# EAGLE design esp32_cam_rev_A (EAGLE 9.3.1)
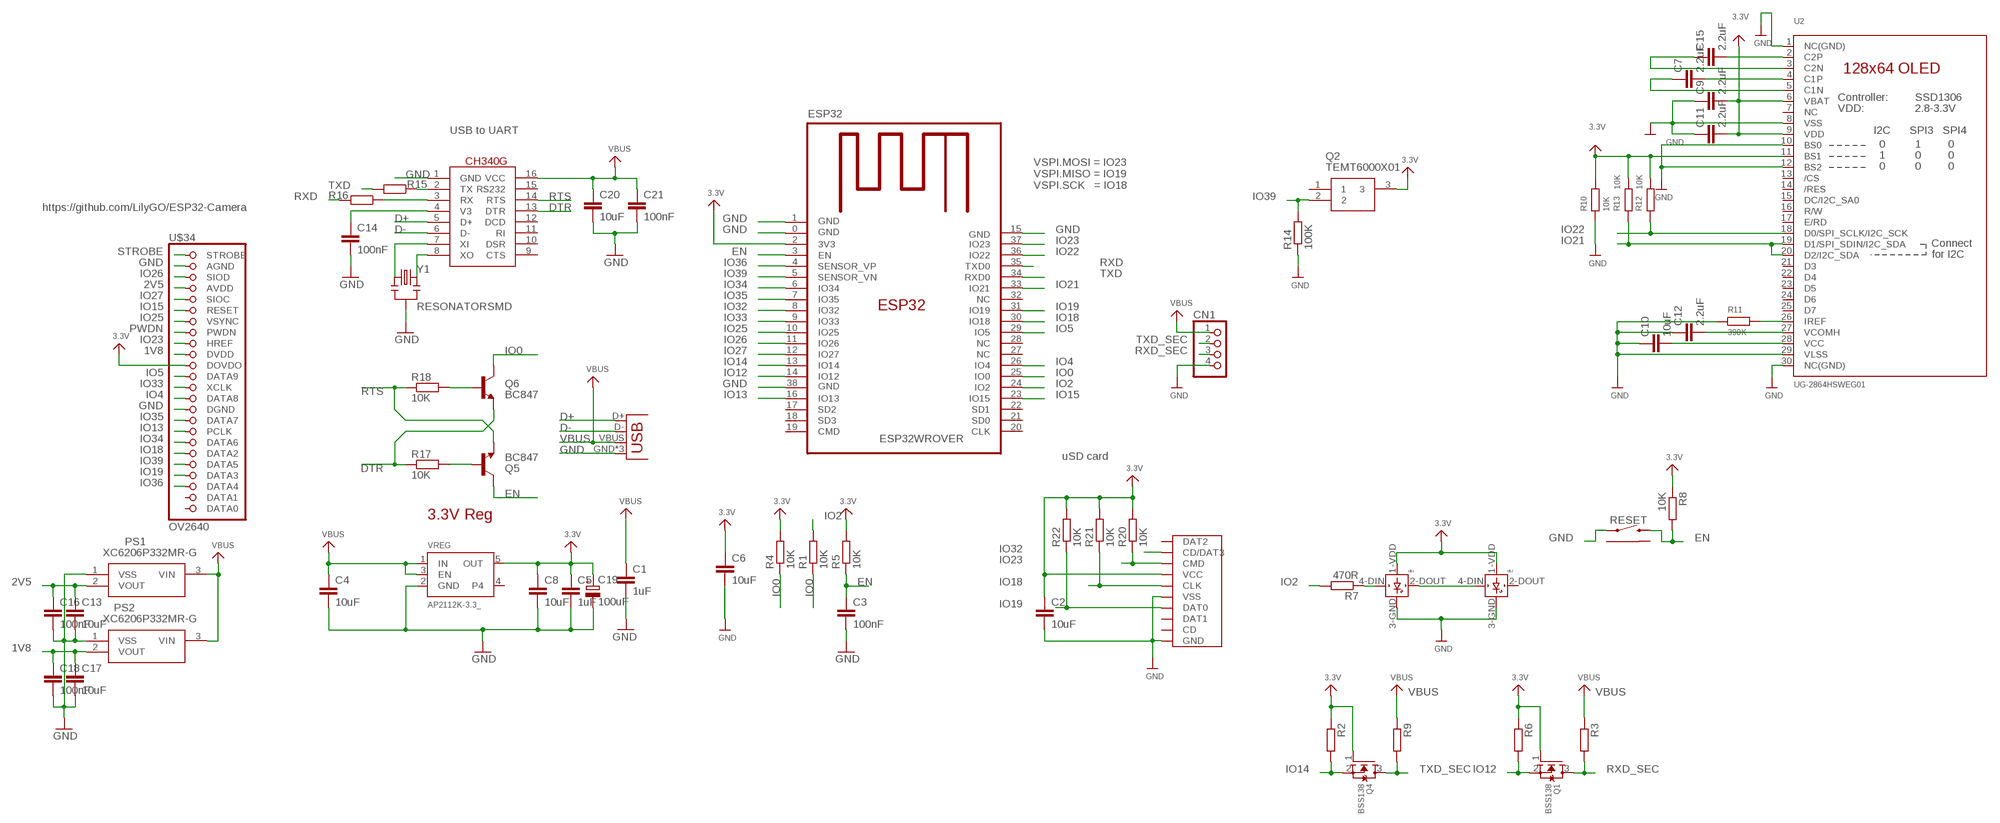
[diagram p0: schematic, sheet 1]

## Parts
C1  1uF  C-EUC0805K  [C0805K]
C2  10uF  C-EUC0805K  [C0805K]
C3  100nF  C-EUC0805K  [C0805K]
C4  10uF  C-EUC0805K  [C0805K]
C5  1uF  C-EUC0805K  [C0805K]
C6  10uF  C-EUC0805K  [C0805K]
C7  2.2uF  C-EUC0805  [C0805]
C8  10uF  C-EUC0805K  [C0805K]
C9  2.2uF  C-EUC0805  [C0805]
C10  10uF  C-EUC0805  [C0805]
C11  2.2uF  C-EUC0805  [C0805]
C12  2.2uF  C-EUC0805  [C0805]
C13  10uF  C-EUC0805K  [C0805K]
C14  100nF  C-EUC0805K  [C0805K]
C15  2.2uF  C-EUC0805  [C0805]
C16  100nF  C-EUC0805K  [C0805K]
C17  10uF  C-EUC0805K  [C0805K]
C18  100nF  C-EUC0805K  [C0805K]
C19  100uF  CPOL-EUCT6032  [CT6032]
C20  10uF  C-EUC0805K  [C0805K]
C21  100nF  C-EUC0805K  [C0805K]
CN1  JST_PH4  [JSTPH4]
ESP32  ESP32WROVER  [ESP32WROVER]
PS1  XC6206P332MR-G  [SOT95P280X130-3N]
PS2  XC6206P332MR-G  [SOT95P280X130-3N]
Q1  BSS138  MOSFET_N_  [SOT95P240X110-3]
Q2  TEMT6000X01  [TEMT6000X01]
Q4  BSS138  MOSFET_N_  [SOT95P240X110-3]
Q5  BC847  TRANSISTOR_NPNSOT23-3  [SOT23-3]
Q6  BC847  TRANSISTOR_NPNSOT23-3  [SOT23-3]
R1  10K  R-EU_R0805  [R0805]
R2  10K  R-EU_R0805  [R0805]
R3  10K  R-EU_R0805  [R0805]
R4  10K  R-EU_R0805  [R0805]
R5  10K  R-EU_R0805  [R0805]
R6  10K  R-EU_R0805  [R0805]
R7  470R  R-EU_R0805  [R0805]
R8  10K  R-EU_R0805  [R0805]
R9  10K  R-EU_R0805  [R0805]
R10  10K  R-EU_R0805  [R0805]
R11  390K  R-EU_R0805  [R0805]
R12  10K  R-EU_R0805  [R0805]
R13  10K  R-EU_R0805  [R0805]
R14  100K  R-EU_R0805  [R0805]
R15  470R  R-EU_R0805  [R0805]
R16  470R  R-EU_R0805  [R0805]
R17  10K  R-EU_R0805  [R0805]
R18  10K  R-EU_R0805  [R0805]
R20  10K  R-EU_R0805  [R0805]
R21  10K  R-EU_R0805  [R0805]
R22  10K  R-EU_R0805  [R0805]
RESET  TACTILE_SWITCH_RIGHT_ANGLE_THT"  [TACTILE_SWITCH_RIGHT_ANGLE_THT]
SD_CARD  MICRO_SD_CARD"  [TFP09-2--12B]
U2  UG-2864HSWEG01  DISP_OLED_UG-2864HSWEG01_  [UG-2864HSWEG01_1.3_WRAPAROUND_MIRRORED]
U$1  WS2812B  [WS2812B_5050]
U$2  WS2812B  [WS2812B_5050]
U$23  CH340G  [SO16]
U$34  OV2640  [FH12-24S-0.5SH]
USB  USB_MICRO_ATTEND_  [USB_MICRO]
VREG  AP2112K-3.3_  [SOT95P290X120-5]
Y1  RESONATORSMD  [RESONATOR-SMD]

## Nets
1V8: C17.1 C18.1 PS2.2(VOUT) U$34.10(DVDD)
2V5: C13.1 C16.1 PS1.2(VOUT) U$34.4(AVDD)
3.3V: C2.1 C5.1 C6.1 C8.1 C9.2 C11.2 C19.+ ESP32.2(3V3) Q1.1(G) Q2.3 Q4.1(G) R2.1 R4.2 R5.2 R6.1 R8.1 R10.2 R12.2 R13.2 R20.2 R21.2 R22.2 SD_CARD.VCC U2.6(VBAT) U2.9(VDD) U2.11(BS1) U$1.1-VDD(VDD) U$2.1-VDD(VDD) U$34.11(DOVDO) VREG.5(OUT)
D+: U$23.5(D+) USB.D+
D-: U$23.6(D-) USB.D-
DTR: Q6.2(E) R17.1 U$23.13(DTR)
EN: C3.1 ESP32.3(EN) Q5.3(C) R5.1 R8.2 RESET.2
GND: C1.2 C2.2 C3.2 C4.2 C5.2 C6.2 C8.2 C9.1 C10.1 C11.1 C12.1 C13.2 C14.2 C16.2 C17.2 C18.2 C19.- C20.2 C21.2 CN1.4 ESP32.0(GND) ESP32.1(GND) ESP32.15(GND) ESP32.38(GND) PS1.1(VSS) PS2.1(VSS) R10.1 R11.1 R14.1 RESET.1 SD_CARD.GND SD_CARD.GND@1(GND) SD_CARD.GND@2(GND) SD_CARD.GND@3(VSS) SD_CARD.VSS(GND) U2.1(NC(GND)) U2.8(VSS) U2.10(BS0) U2.12(BS2) U2.29(VLSS) U2.30(NC(GND)) U$1.3-GND(GND) U$2.3-GND(GND) U$23.1(GND) U$34.2(AGND) U$34.15(DGND) USB.GND USB.GND@2(GND) USB.GND@3(GND) VREG.2(GND) Y1.2
IO0: ESP32.25(IO0) Q6.3(C) R1.1 R4.1
IO2: ESP32.24(IO2) R1.2 R7.2
IO4: ESP32.26(IO4) U$34.14(DATA8)
IO5: ESP32.29(IO5) U$34.12(DATA9)
IO12: ESP32.14(IO12) Q1.2(S) R6.2
IO13: ESP32.16(IO13) U$34.17(PCLK)
IO14: ESP32.13(IO14) Q4.2(S) R2.2
IO15: ESP32.23(IO15) U$34.6(RESET)
IO18: ESP32.30(IO18) R21.1 SD_CARD.CLK U$34.19(DATA2)
IO19: ESP32.31(IO19) R22.1 SD_CARD.DAT0 U$34.21(DATA3)
IO21: ESP32.33(IO21) R13.1 U2.19(D1/SPI_SDIN/I2C_SDA) U2.20(D2/I2C_SDA)
IO22: ESP32.36(IO22) R12.1 U2.18(D0/SPI_SCLK/I2C_SCK)
IO23: ESP32.37(IO23) R20.1 SD_CARD.CMD U$34.9(HREF)
IO25: ESP32.10(IO25) U$34.7(VSYNC)
IO26: ESP32.11(IO26) U$34.3(SIOD)
IO27: ESP32.12(IO27) U$34.5(SIOC)
IO32: ESP32.8(IO32) SD_CARD.CD/DAT3
IO33: ESP32.9(IO33) U$34.13(XCLK)
IO34: ESP32.6(IO34) U$34.18(DATA6)
IO35: ESP32.7(IO35) U$34.16(DATA7)
IO36: ESP32.4(SENSOR_VP) U$34.22(DATA4)
IO39: ESP32.5(SENSOR_VN) Q2.2 R14.2 U$34.20(DATA5)
N$2: R7.1 U$1.4-DIN(DIN)
N$3: U$1.2-DOUT(DOUT) U$2.4-DIN(DIN)
N$6: R11.2 U2.26(IREF)
N$7: C15.2 U2.2(C2P)
N$8: U$23.8(XO) Y1.3
N$9: C15.1 U2.3(C2N)
N$10: C7.2 U2.4(C1P)
N$11: C7.1 U2.5(C1N)
N$12: C10.2 U2.28(VCC)
N$13: C12.2 U2.27(VCOMH)
N$16: U$23.7(XI) Y1.1
N$22: C14.1 U$23.4(V3)
N$23: R15.1 U$23.2(TX)
N$24: R16.1 U$23.3(RX)
N$25: Q5.1(B) R17.2
N$26: Q6.1(B) R18.2
PWDN: U$34.8(PWDN)
RTS: Q5.2(E) R18.1 U$23.14(RTS)
RXD: ESP32.35(TXD0) R16.2
RXD_SEC: CN1.3 Q1.3(D) R3.2
STROBE: U$34.1(STROBE)
TXD: ESP32.34(RXD0) R15.2
TXD_SEC: CN1.2 Q4.3(D) R9.2
VBUS: C1.1 C4.1 C20.1 C21.1 CN1.1 PS1.3(VIN) PS2.3(VIN) R3.1 R9.1 U$23.16(VCC) USB.VBUS VREG.1(IN) VREG.3(EN)
Unconnected: ESP32.17(SD2) ESP32.18(SD3) ESP32.19(CMD) ESP32.20(CLK) ESP32.21(SD0) ESP32.22(SD1) ESP32.27(NC) ESP32.28(NC) ESP32.32(NC) Q2.1 RESET.ANCHOR1 RESET.ANCHOR2 SD_CARD.CD SD_CARD.DAT1 SD_CARD.DAT2 U2.7(NC) U2.13(/CS) U2.14(/RES) U2.15(DC/I2C_SA0) U2.16(R/W) U2.17(E/RD) U2.21(D3) U2.22(D4) U2.23(D5) U2.24(D6) U2.25(D7) U$2.2-DOUT(DOUT) U$23.9(CTS) U$23.10(DSR) U$23.11(RI) U$23.12(DCD) U$23.15(RS232) U$34.23(DATA1) U$34.24(DATA0) VREG.4

## Notes on the sheet
- USB to UART
- VSPI.MOSI = IO23
  VSPI.MISO = IO19
  VSPI.SCK   = IO18
- https://github.com/LilyGO/ESP32-Camera
- uSD card
- 3.3V Reg

## Library data of the parts
C1-C18 C20 C21 = rcl:C-EU: CAPACITOR, European symbol; SPICEPREFIX: C
C19 = rcl:CPOL-EU: POLARIZED CAPACITOR, European symbol; SPICEPREFIX: C
CN1 = dronecz:JST_PH4: JST 4-Pin Right-Angle Connector 4UConnector: 17312
ESP32 = dronecz:ESP32WROVER
PS1 PS2 = SamacSys_Parts:XC6206P332MR-G: LDO Voltage Regulators Source: Datasheet <https://www.torexsemi.com/file/xc6206/XC6206.pdf>; DESCRIPTION: LDO Voltage Regulators; HEIGHT: 1.3mm; MANUFACTURER_NAME: Torex; MANUFACTURER_PART_NUMBER: XC6206P332MR-G; MOUSER_PART_NUMBER: 865-XC6206P332MR-G
Q1 Q4 = dronecz:MOSFET_N
Q2 = SamacSys_Parts:TEMT6000X01: Ambient Light Sensor 570nm SMD3 Vishay TEMT6000X01 +/-60 Visible Light Phototransistor, Surface Mount 3-Pin 1206 package Source: Datasheet <https://componentsearchengine.com/Datasheets/1/TEMT6000X01.pdf>; DESCRIPTION: Ambient Light Sensor 570nm SMD3 Vishay TEMT6000X01 +/-60 Visible Light Phototransistor, Surface Mount 3-Pin 1206 package; HEIGHT: mm; MANUFACTURER_NAME: Vishay; MANUFACTURER_PART_NUMBER: TEMT6000X01; MOUSER_PART_NUMBER: 78-TEMT6000
Q5 Q6 = SparkFun:TRANSISTOR_NPN: Transistor NPN BJT configuration in SOT23 package. MMBT2222 is the common NPN we use. Double check BCE configuration again layout.
R1-R18 R20-R22 = rcl:R-EU_: RESISTOR, European symbol; SPICEPREFIX: R
RESET = dronecz:TACTILE_SWITCH_RIGHT_ANGLE_THT
SD_CARD = dronecz:MICRO_SD_CARD
U2 = microbuilder:DISP_OLED_UG-2864HSWEG01: UG-2864HSWEG01 OLED display Both 1.3" and 0.96" models share the same FPC tab footprint, only the screen dimensions vary.
U$1 U$2 = dronecz:WS2812B
U$23 = dronecz:CH340G
U$34 = dronecz:OV2640
USB = dronecz:USB_MICRO_ATTEND: https://www.tme.eu/cz/Document/1cbb1fe1d020818ecbe0fffe16726397/207A-BBA0-R.pdf
VREG = dronecz:AP2112K-3.3
Y1 = SparkFun:RESONATOR: Resonator Small SMD resonator. This is the itty bitty 10/20MHz resonators with built in caps. CSTCE10M0G55 and CSTCE20M0V53. Footprint has been reviewed closely but hasn't been tested yet.

## Board
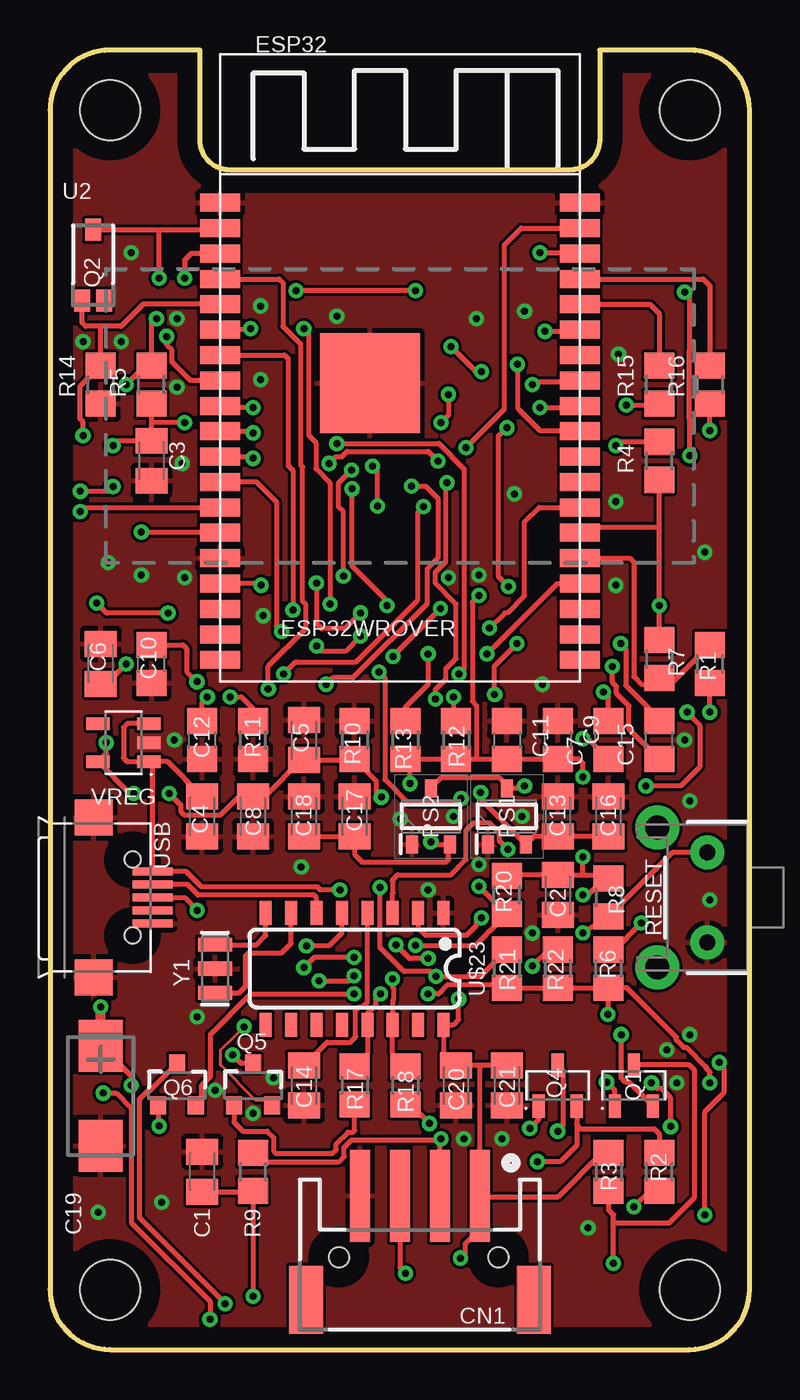
[diagram p1: board, top side]
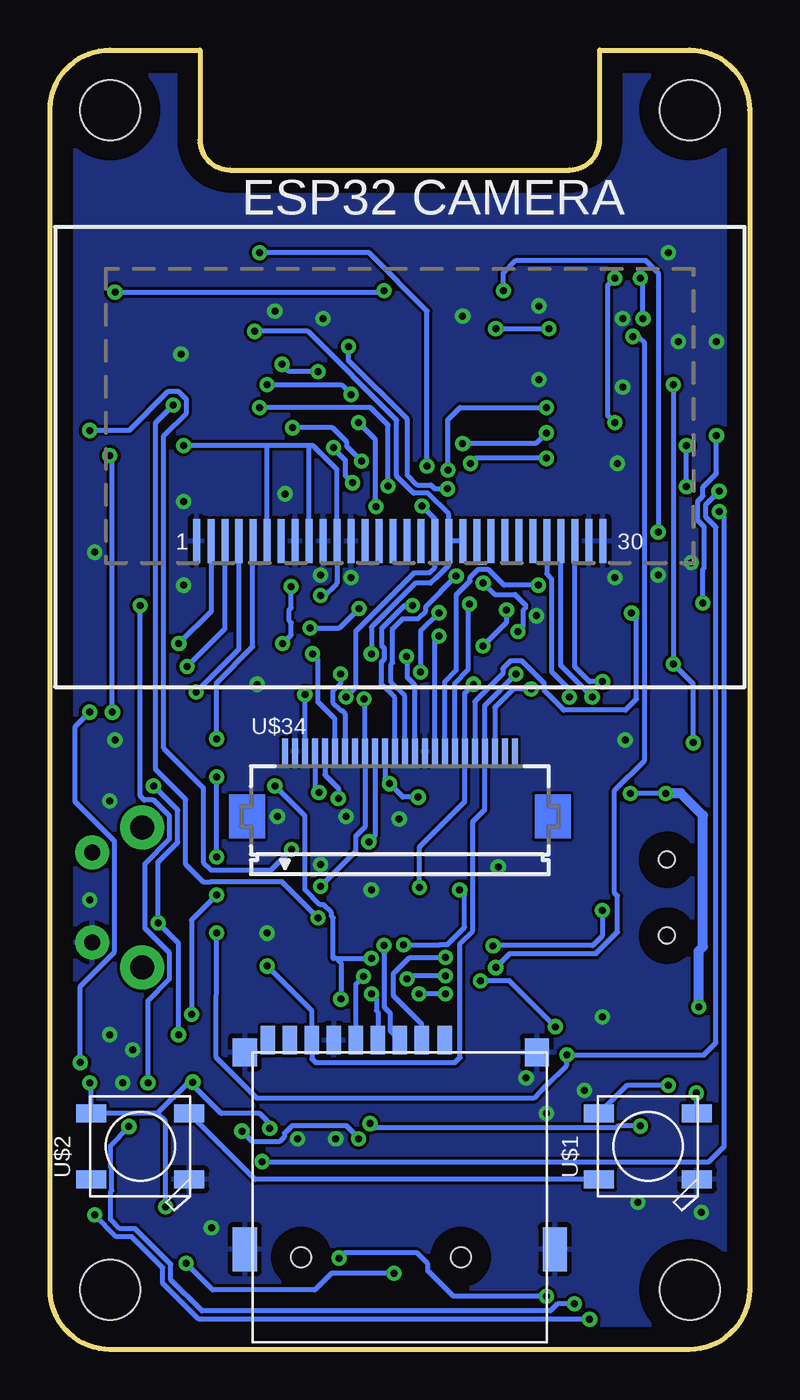
[diagram p2: board, bottom side, seen from below]

Size 35 x 65 mm. Coordinates in mm from the lower left corner, seen from the top.
Outline: 7.5,65 3,65 arc90 0,62 0,3 arc90 3,0 32,0 arc90 35,3 35,62 arc90 32,65 27.5,65 27.5,60.5 arc-90 26,59 9,59 arc-90 7.5,60.5 7.5,65
Copper layers (1*16): Top 0.035mm / dielectric 1.5mm / Bottom 0.035mm
Design rules "default": minimum track width 6mil, minimum drill 0.35mm, track to track 6mil, track to pad 6mil, pad to pad 6mil, via to via 6mil, smd to smd 6mil, copper to edge 40mil, drill to drill 6mil, minimum pad ring 10mil, minimum via ring 8mil, stop-mask expansion 4mil, vias tented up to drill 0mil, thermal gap 10mil
Holes 3 mm at 32,3 3,62 32,62 3,3

### Footprints (pad centres in the part's own frame; a part is rotated, then mirrored left to right if it is on the bottom)
C0805K = smd 1.3 x 1.6: 1 -1,0; 2 1,0
C0805 = smd 1.3 x 1.5: 1 -0.95,0; 2 0.95,0
CT6032 = smd 2.6 x 2.2: + -2.5,0; - 2.5,0
JSTPH4 = smd 1 x 4.6: 1 -3,-3.7; 2 -1,-3.7; 3 1,-3.7; 4 3,-3.7 | smd 1.7 x 3.4: NC1 -5.7,1.5; NC2 5.7,1.5
ESP32WROVER = smd 5 x 5: 0 -1.5,-0.75 | smd 2 x 0.9: 1 -9,8.26; 2 -9,6.99; 3 -9,5.72; 4 -9,4.45; 5 -9,3.18; 6 -9,1.91; 7 -9,0.64; 8 -9,-0.63; 9 -9,-1.9; 10 -9,-3.17; 11 -9,-4.44; 12 -9,-5.71; 13 -9,-6.98; 14 -9,-8.25; 15 -9,-9.52; 16 -9,-10.79; 17 -9,-12.06; 18 -9,-13.33; 19 -9,-14.6; 20 9,-14.6; 21 9,-13.33; 22 9,-12.06; 23 9,-10.79; 24 9,-9.52; 25 9,-8.25; 26 9,-6.98; 27 9,-5.71; 28 9,-4.44; 29 9,-3.17; 30 9,-1.9; 31 9,-0.63; 32 9,0.64; 33 9,1.91; 34 9,3.18; 35 9,4.45; 36 9,5.72; 37 9,6.99; 38 9,8.26
SOT95P280X130-3N = smd 0.9 x 0.6: 1 -1.4,0.95; 2 -1.4,-0.95; 3 1.4,0
SOT95P240X110-3 = smd 1.18 x 0.609: 1 -1.024,0.95; 2 -1.024,-0.95; 3 1.024,0
TEMT6000X01 = smd 1.1 x 0.8: 1 -1.775,-0.55; 2 -1.775,0.55; 3 1.775,0
SOT23-3 = smd 0.8 x 0.9: 1 -0.95,-1; 2 0.95,-1; 3 0,1.1
R0805 = smd 1.3 x 1.5: 1 -0.95,0; 2 0.95,0
TACTILE_SWITCH_RIGHT_ANGLE_THT = drill 0.8 pad 1.7: 1 2.25,0; 2 -2.25,0 | drill 1.2 pad 2.2: ANCHOR1 3.5,-2.5; ANCHOR2 -3.5,-2.5
TFP09-2--12B = smd 0.711 x 1.422: CD -6.6,7.85; CD/DAT3 1.1,7.85; CLK -2.2,7.85; CMD 0,7.85; DAT0 -4.4,7.85; DAT1 -5.5,7.85; DAT2 2.25,7.85; VCC -1.1,7.85; VSS -3.3,7.85 | smd 1.2 x 2.2: GND -7.75,-2.6; GND@1 7.75,-2.6 | smd 1.2 x 1.4: GND@2 -7.75,7.25; GND@3 6.85,7.25 | hole 1: -4.93,-3; 3.05,-3
UG-2864HSWEG01_1.3_WRAPAROUND_MIRRORED = smd 0.35 x 2.2 bottom: 1 10.17,-0.2; 2 9.45,-0.2; 3 8.75,-0.2; 4 8.05,-0.2; 5 7.35,-0.2; 6 6.65,-0.2; 7 5.95,-0.2; 8 5.25,-0.2; 9 4.55,-0.2; 10 3.85,-0.2; 11 3.15,-0.2; 12 2.45,-0.2; 13 1.75,-0.2; 14 1.05,-0.2; 15 0.35,-0.2; 16 -0.35,-0.2; 17 -1.05,-0.2; 18 -1.75,-0.2; 19 -2.45,-0.2; 20 -3.15,-0.2; 21 -3.85,-0.2; 22 -4.55,-0.2; 23 -5.25,-0.2; 24 -5.95,-0.2; 25 -6.65,-0.2; 26 -7.35,-0.2; 27 -8.05,-0.2; 28 -8.75,-0.2; 29 -9.45,-0.2; 30 -10.17,-0.2
WS2812B_5050 = smd 1.5 x 0.9: 1-VDD 2.45,-1.65; 2-DOUT 2.45,1.65; 3-GND -2.45,1.65; 4-DIN -2.45,-1.65
SO16 = smd 0.6 x 1.2: 1 -4.445,-2.8; 2 -3.175,-2.8; 3 -1.905,-2.8; 4 -0.635,-2.8; 5 0.635,-2.8; 6 1.905,-2.8; 7 3.175,-2.8; 8 4.445,-2.8; 9 4.445,2.8; 10 3.175,2.8; 11 1.905,2.8; 12 0.635,2.8; 13 -0.635,2.8; 14 -1.905,2.8; 15 -3.175,2.8; 16 -4.445,2.8
FH12-24S-0.5SH = smd 0.3 x 1.3: 1 -5.75,3.25; 2 -5.25,3.25; 3 -4.75,3.25; 4 -4.25,3.25; 5 -3.75,3.25; 6 -3.25,3.25; 7 -2.75,3.25; 8 -2.25,3.25; 9 -1.75,3.25; 10 -1.25,3.25; 11 -0.75,3.25; 12 -0.25,3.25; 13 0.25,3.25; 14 0.75,3.25; 15 1.25,3.25; 16 1.75,3.25; 17 2.25,3.25; 18 2.75,3.25; 19 3.25,3.25; 20 3.75,3.25; 21 4.25,3.25; 22 4.75,3.25; 23 5.25,3.25; 24 5.75,3.25
USB_MICRO = smd 0.4 x 2: D+ 0,3.1; D- -0.65,3.1; GND 1.3,3.1; ID 0.65,3.1; VBUS -1.3,3.1 | smd 1.8 x 1.9: GND@2 -4,0.15; GND@3 4,0.15 | hole 0.8: -1.9,2.1; 1.9,2.1
SOT95P290X120-5 = smd 1.18 x 0.609: 1 -1.274,0.95; 2 -1.274,0; 3 -1.274,-0.95; 4 1.274,-0.95; 5 1.274,0.95
RESONATOR-SMD = smd 0.7 x 1.7: 1 -1.2,0; 2 0,0; 3 1.2,0

### Placement (x,y rotation side)
C1  7.62,8.89 90 top
C2  25.4,22.73 270 top
C3  5.08,44.45 270 top
C4  7.62,26.67 270 top
C5  12.7,30.48 90 top
C6  2.54,34.29 90 top
C7  27.94,30.48 90 top
C8  10.16,26.67 270 top
C9  25.4,30.48 270 top
C10  5.08,34.29 90 top
C11  22.86,30.48 270 top
C12  7.62,30.48 90 top
C13  25.4,26.67 90 top
C14  12.7,13.21 270 top
C15  30.48,30.48 90 top
C16  27.94,26.67 90 top
C17  15.24,26.67 90 top
C18  12.7,26.67 90 top
C19  2.54,12.7 270 top
C20  20.32,13.21 270 top
C21  22.86,13.21 270 top
CN1  18.5,4 180 top
ESP32  17.5,49.1 0 top
PS1  22.86,26.67 90 top
PS2  19.05,26.67 90 top
Q1  29.21,13.21 90 top
Q2  2.16,54.23 90 top
Q4  25.4,13.21 90 top
Q5  10.16,13.21 0 top
Q6  6.35,13.21 0 top
R1  30.48,34.54 270 top
R2  30.48,8.89 90 top
R3  27.94,8.89 270 top
R4  30.48,44.45 90 top
R5  5.08,48.26 90 top
R6  27.94,19.05 90 top
R7  33.02,34.29 90 top
R8  27.94,22.61 270 top
R9  10.16,8.89 90 top
R10  15.24,30.48 270 top
R11  10.16,30.48 90 top
R12  20.32,30.48 270 top
R13  17.78,30.48 270 top
R14  2.54,48.26 90 top
R15  30.48,48.26 90 top
R16  33.02,48.26 90 top
R17  15.24,13.21 270 top
R18  17.78,13.21 270 top
R20  22.86,22.73 90 top
R21  22.86,19.05 270 top
R22  25.4,19.05 270 top
RESET  32.89,22.61 270 top
SD_CARD  17.5,7.62 0 bottom
U2  17.5,40.64 0 top
U$1  5.08,10.16 180 bottom
U$2  30.48,10.16 180 bottom
U$23  15.24,19.05 180 top
U$34  17.5,26.67 0 bottom
USB  2.03,22.61 270 top
VREG  3.68,30.35 180 top
Y1  8.26,19.05 90 top

### Tracks (layer width: path | path; a pad name or v marks a point on that pad's centre or on a via)
1V8  (via drill 0.35)
  Top 0.254: C18.1 C17.1 15.24,24.77 15.62,24.38 19.81,24.38 19.94,24.51 19.94,25.21 PS2.2 19.18,25.27 v19.05,25.4
  Bottom 0.254: U$34.10 18.75,25.7 v19.05,25.4
2V5  (via drill 0.35)
  Top 0.254: C16.1 C13.1 24.21,25.67 PS1.2 21.55,27.53 v21.55,27.86
  Bottom 0.254: U$34.4 21.75,28.06 v21.55,27.86
3.3V  (via drill 0.35)
  Top 0.254: Q2.3 5.46,56 | 5.46,56 8.41,56 ESP32.2 | 21.34,29.53 R12.2 R13.2 18.02,29.3 v18.02,28.3 | 21.34,29.53 C11.2 C9.2 26.48,29.53 26.67,29.34 v26.67,28.64 | v4.19,27.81 4,27.81 VREG.5 2.82,29.81 v2.82,30.35 | v5.97,27.81 6.54,27.24 6.54,26.9 6.7,26.74 8.54,26.74 9.46,27.67 C8.1 10.76,27.67 12.57,29.48 C5.1 15.19,29.48 R10.2 16.32,28.45 16.32,27.88 v16.58,27.63 | v18.92,17.78 19.43,17.78 19.87,18.23 22.73,18.23 R21.2 R22.2 R6.1 | R20.2 22.91,23.73 C2.1 26.67,23.73 | 26.67,23.73 27.76,23.73 R8.1 27.75,23.56 26.92,22.73 v26.67,22.73 | Q4.1 24.45,11.52 v24,11.07 | R2.1 30.03,7.94 v29.22,7.13 | v27.92,16.76 27.94,16.79 R6.1 | C19.+ 4.06,13.68 v4.06,13.21 | R4.2 28.51,45.4 v28.32,45.21 | v3.81,48.26 4.76,49.21 R5.2 5.08,51.32 v5.33,51.57 | v3.81,34.29 2.81,33.29 C6.1 | v5.46,53.59 5.46,56 | 26.67,23.73 v26.67,24.64 | v21.46,37.72 21.13,37.39 21.13,32.41 21.35,32.2 21.35,29.54 21.34,29.53 | v33.02,13.34 33.02,13.88 32.82,14.08 32.82,14.15 31.88,15.09 31.73,15.09 31.35,15.48 31.35,15.62 28.87,18.1 R6.1 | Q1.1 28.26,12.96 v27.85,13.37
  Top 0.508: C19.+ v2.54,17.14
  Bottom 0.254: v4.19,27.81 v5.97,27.81 | v18.92,17.78 18.67,17.53 18.67,16.95 18.6,16.88 SD_CARD.VCC | 29.62,11.81 U$2.1-VDD 32.93,13.24 v33.02,13.34 | v24,11.07 24,11.3 24.51,11.81 26.43,11.81 27.85,13.22 v27.85,13.37 28.06,13.37 29.62,11.81 | v29.22,7.13 29.22,11.4 29.62,11.81 | v26.67,22.73 27.92,21.49 v27.92,16.76 | v4.06,13.21 6.13,13.21 U$1.1-VDD | 24.13,45.21 v28.32,45.21 | v21.46,37.72 21.36,37.61 20.65,38.32 U2.11 20.65,44.02 21.84,45.21 21.97,45.21 | 21.97,45.21 24.13,45.21 | 21.97,45.21 22.05,45.13 U2.9 | U2.6 24.15,45.19 24.13,45.21 | v3.81,48.26 v3.81,34.29 2.82,33.3 v2.82,30.35 | v5.33,51.57 5.33,53.46 v5.46,53.59 | v26.67,24.64 v26.67,28.64 | U$34.11 18.25,28.54 v18.02,28.3 17.34,27.63 v16.58,27.63
  Bottom 0.508: v2.54,17.14 2.54,19.94 2.33,20.14 2.33,26.72 3.43,27.81 v4.19,27.81
D+  (via drill 0.35)
  Top 0.254: USB.D+ 6.73,22.61 v7.37,21.97 | U$23.5 14.61,20.83 13.96,20.19 v12.83,20.19
  Bottom 0.254: v7.37,21.97 7.37,20.69 7.84,20.21 12.81,20.21 v12.83,20.19
D-
  Top 0.254: U$23.6 13.34,22.61 13.21,22.73 7.41,22.73 6.88,23.26 USB.D-
DTR  (via drill 0.35)
  Top 0.254: R17.1 15.88,14.79 U$23.13 15.88,16.81 16.28,17.21 16.28,17.53 v16.53,17.78 | v15.22,17.79 10.04,17.79 8.03,15.77 8.03,13.65 7.6,13.23 7.6,12.51 Q6.2
  Bottom 0.254: v15.22,17.79 v16.53,17.79 v16.53,17.78
EN  (via drill 0.35)
  Top 0.254: v26.67,20.84 27.89,21.66 R8.2 31.14,24.86 RESET.2 | 5.08,46.35 C3.1 3.39,45.45 v3.15,45.21 | 5.08,46.35 R5.1 | ESP32.3 7.07,54.82 6.73,54.48 v6.73,53.59 | v6.73,46.35 5.08,46.35 | Q5.3 9.57,14.31 v9.14,14.73 | v1.52,42.93 2.92,42.93 v3.15,43.16
  Bottom 0.254: v26.67,20.84 26.68,14.61 24.65,12.57 10.79,12.57 10.41,12.95 10.16,13.21 9.14,14.22 v9.14,14.73 2.29,14.73 1.68,15.34 1.68,41.13 2.18,41.64 2.18,42.27 v1.52,42.93 | v6.73,53.59 7.11,53.21 7.11,46.74 v6.73,46.35 | v3.15,43.16 v3.15,45.21
GND  (via drill 0.35)
  other vias: 10.16,11.81 11.18,13.59 19.94,38.61 21.46,38.73 6.73,38.61 6.6,44.32 2.92,39.37 4.06,54.86 28.32,38.23 28.32,42.42 23.24,42.8 32.77,39.88 21.34,51.56 14.35,51.69 7.37,16.64 18.92,22.99 17.53,26.54 20.19,26.67 24.13,20.83 33.02,22.48 32,27.43 32,15.75 24.64,33.27 21.46,24.26 12.57,24.13 10.67,36.7 6.22,30.48 20.7,10.54 22.61,10.54 8.26,12.95 2.41,6.86 5.59,7.37 23.62,26.67 31.75,30.48 26.92,6.1 31.37,13.34 30.86,14.99 28.45,49.78 23.75,51.94 10.54,48.51 10.54,52.2 3.56,50.42 1.65,50.42 6.35,51.56 6.35,48.13 4.57,38.73
  pour Top: 0,0 35.05,0 35.05,65.15 0.13,65.15 0,65.15
  pour Bottom: 0,0 35.05,0 35.05,65.15 0,65.15
IO0  (via drill 0.35)
  Top 0.254: R1.1 v30.48,37.21 30.48,41.1 | 30.48,41.1 R4.1 | 30.48,41.1 26.75,41.1 ESP32.25 | Q6.3 4.98,12.94 4.88,12.94 4.47,12.52 4.47,6.6 8.76,2.31 v8.76,2.29 | v30.1,13.34 30.38,13.05 30.58,13.05 31.05,12.58 v31.05,11.15
  Bottom 0.254: v8.76,2.29 9.61,2.29 9.97,1.93 27.39,1.93 28.95,3.49 28.95,4.26 30.74,6.05 31.51,6.05 31.97,6.51 31.97,7.87 31.9,7.94 31.9,9.08 31.97,9.15 31.97,10.19 31.05,11.11 v31.05,11.15 | v30.1,13.34 30.1,17.45 29.01,18.54 29.01,19.83 30.25,21.06 30.25,24.3 29.01,25.54 29.01,26.68 29.82,27.48 30.28,27.48 30.48,27.69 v30.48,37.21
IO2
  Top 0.254: R1.2 30.86,33.59 30.61,33.34 | 30.61,33.34 31.12,33.34 R7.2 | ESP32.24 29,39.58 29.21,39.37 29.21,33.66 29.59,33.27 30.54,33.27 30.61,33.34
IO4  (via drill 0.35)
  Top 0.254: v21.99,36.09 22.76,36.85 22.88,36.85 23.75,37.72 23.75,41.4 24.47,42.12 ESP32.26 | v19.53,37.06 17.15,34.68 v17.15,34.66
  Bottom 0.254: v21.99,36.09 20.51,36.09 v19.53,37.06 | U$34.14 16.75,33.23 17.12,33.61 17.12,34.63 v17.15,34.66
IO5  (via drill 0.35)
  Top 0.254: v20.07,50.16 21.31,48.92 v21.59,48.92 | v23.39,49.28 23.39,47.09 24.51,45.97 26.46,45.97 ESP32.29 | v15.11,43.05 15.11,39.18 16.86,37.43 v16.86,37.21
  Bottom 0.254: v20.07,50.16 20.07,49.47 17.12,46.53 17.12,43.73 16.63,43.24 15.94,43.24 15.75,43.05 v15.11,43.05 | v21.59,48.92 23.03,48.92 v23.39,49.28 | U$34.12 17.75,32.61 18.41,33.27 18.41,34.38 18.27,34.53 18.27,35.07 18.41,35.22 18.41,36.06 17.27,37.21 v16.86,37.21
IO12  (via drill 0.35)
  Top 0.254: R6.2 27.94,19.89 28.15,19.89 v29.59,21.34 | Q1.2 28.98,13.36 28.79,13.36 28.57,13.58 v28.57,15.75 | v29.82,28.19 29.85,28.22 31.6,28.22 32.51,29.13 32.51,31.24 v31.88,31.88 | v31.75,52.89 32,52.64 32,49.99 31.99,49.98 31.99,46.54 32,46.53 v32,44.7 | v18.29,52.96 v12.32,52.96 | v4.57,40.89 8.46,40.89 ESP32.14
  Bottom 0.254: v28.57,15.75 28.57,20.32 v29.59,21.34 29.59,24.38 28.61,25.37 28.61,26.98 v29.82,28.19 | v31.88,31.88 31.88,44.58 v32,44.7 | v31.75,52.89 18.36,52.89 v18.29,52.96 | v12.32,52.96 12.32,53.85 11.68,54.48 5.21,54.48 4.57,53.85 v4.57,40.89
IO13  (via drill 0.35)
  Top 0.254: v10.56,38.23 10.48,38.31 ESP32.16
  Bottom 0.254: v10.56,38.23 12.28,38.23 13.05,39 13.6,39 13.98,38.62 13.98,38.44 14.67,37.76 14.67,33.98 15.25,33.4 U$34.17
IO14  (via drill 0.35)
  Top 0.254: R2.2 30.48,10.79 30.23,11.05 26.54,11.05 26.35,11.24 Q4.2 26.35,10.22 25.53,9.4 v24.38,9.4 | v1.52,41.91 1.73,42.12 ESP32.13
  Bottom 0.254: v24.38,9.4 2.03,9.4 1.27,10.16 1.27,41.66 v1.52,41.91
IO15  (via drill 0.35)
  Top 0.254: v21.87,34.8 25.38,38.31 ESP32.23
  Bottom 0.254: U$34.6 20.75,31.55 21.59,32.38 21.59,34.52 v21.87,34.8
IO18  (via drill 0.35)
  Top 0.254: R21.1 21.53,18.67 v19.3,18.67 19.07,18.9 17.72,18.9 16.51,20.11 v16.51,23.11 | v24.51,47.12 26.42,47.12 ESP32.30 | v18.08,43.18 18.8,43.18 19.41,42.57 19.41,39.58 18.88,39.05 18.88,37.31 15.17,33.61 14.16,33.61 v13.82,33.27
  Bottom 0.254: SD_CARD.CLK 19.7,18.27 v19.3,18.67 | v18.08,43.18 18.08,46.23 18.97,47.12 v24.51,47.12 | v16.51,23.11 16.51,25.15 14.25,27.41 U$34.19 14.25,32.84 v13.82,33.27
IO19  (via drill 0.35)
  Top 0.254: v24.14,19.18 24.96,20 R22.1 | ESP32.31 26.42,48.39 24.26,48.39 v24.13,48.26 | v19.94,47.77 19.94,46.74 v19.56,46.35 | v11.68,33.78 12.3,34.39 15.31,34.39 18.4,37.49 18.4,41.87 v18.69,42.16
  Bottom 0.254: v24.14,19.18 21.9,16.94 SD_CARD.DAT0 21.9,14.53 21.72,14.35 14.73,14.35 14.48,14.61 14.48,20.32 13.85,20.95 13.85,22.71 13.84,22.71 13.84,23.26 13.85,23.27 13.85,26.41 13.25,27.01 U$34.21 13.25,32.22 v11.68,33.78 | v24.13,48.26 20.42,48.26 v19.94,47.77 | v19.56,46.35 18.74,45.53 18.74,42.53 18.69,42.48 v18.69,42.16
IO21  (via drill 0.35)
  Top 0.254: v24.77,50.93 26.42,50.93 ESP32.33 | v18.92,34.8 18.92,33.27 17.78,32.13 R13.1
  Bottom 0.254: U2.20 U2.19 | v24.77,50.93 22.1,50.93 17.65,46.48 17.65,43.69 16.8,42.84 16.11,42.84 15.05,41.78 U2.19 | U2.19 15.05,39.24 15.71,38.58 15.96,38.33 16.72,38.33 18.92,36.13 v18.92,34.8
IO22  (via drill 0.35)
  Top 0.254: v24.51,54.86 26.46,54.86 ESP32.36 | v20.19,32.64 20.19,31.56 R12.1 | v16.38,42.18 16.38,43.94 v16.13,44.2
  Bottom 0.254: v24.51,54.86 19.05,54.86 16.13,51.94 v16.13,44.2 | v20.19,32.64 19.68,33.15 19.68,35.94 16.76,38.86 16,38.86 15.75,39.11 U2.18 15.75,41.55 v16.38,42.18
IO23  (via drill 0.35)
  Top 0.254: v18.3,20.22 21.29,20.22 21.83,20.75 21.83,20.77 21.99,20.93 22.01,20.93 R20.1 22.84,21.78 v21.46,23.16 | v19.86,43.35 19.81,43.31 19.81,39.41 19.28,38.88 19.28,38.34 20.32,37.3 20.32,34.56 19.81,34.05 19.81,33.53 19.28,33 v19.28,32.55 | v20.81,45.1 22.73,47.03 22.73,55.24 23.58,56.09 ESP32.37
  Bottom 0.254: SD_CARD.CMD 17.96,15.94 17.96,16.82 18.26,17.12 18.26,19.82 18.3,19.86 v18.3,20.22 | v21.46,23.16 19.71,24.91 19.71,25.67 19.25,26.13 U$34.9 19.25,32.51 v19.28,32.55 | v19.86,43.35 20.24,43.73 20.24,44.49 20.81,45.06 v20.81,45.1
IO25  (via drill 0.35)
  Top 0.254: ESP32.10 10.08,45.93 v10.16,45.85 | v14.35,45.32 19.45,45.32 20.72,44.05 20.72,34.04 v20.47,33.78
  Bottom 0.254: v10.16,45.85 10.69,45.32 v14.35,45.32 | v20.47,33.78 20.47,33.29 20.85,32.91 20.85,32.37 20.46,31.98 20.42,31.98 20.25,31.81 U$34.7
IO26  (via drill 0.35)
  Top 0.254: ESP32.11 10.08,44.66 v10.16,44.58 | v13.97,44.32 14.31,44.66 14.62,44.66 14.88,44.91 18.93,44.91 v19.41,44.43 | v22.86,46.1 22.42,45.66 22.42,38.68 v22.93,38.17 | v22.25,32.77 22.25,34.19 v23.37,35.31
  Bottom 0.254: v10.16,44.58 13.72,44.58 v13.97,44.32 | v19.41,44.43 20.15,45.17 20.15,45.38 20.87,46.1 v22.86,46.1 | U$34.3 v22.25,32.76 v22.25,32.77 | v23.37,35.31 22.93,35.74 22.93,36.35 23.03,36.45 23.03,36.99 22.93,37.1 v22.93,38.17
IO27  (via drill 0.35)
  Top 0.254: ESP32.12 10.33,43.39 11.33,42.4 11.33,36.18 v11.59,35.92 | v16.46,33.88 16.75,33.59 16.75,28.51 17.92,27.34 20.36,27.34 v20.57,27.56 | v15.54,36.85 14.75,36.06 13.58,36.06 13.33,36.31 v13.33,38.35
  Bottom 0.254: v15.54,36.85 15.56,36.85 16.45,35.96 v16.45,33.89 v16.46,33.88 | U$34.5 21.25,28.74 20.57,28.07 v20.57,27.56 | v13.33,38.35 12.74,37.76 11.73,37.76 11.21,37.24 11.21,37.1 11.33,36.98 11.33,36.18 v11.59,35.92
IO32  (via drill 0.35)
  Top 0.254: v15.22,19.61 13.2,19.61 v12.7,19.1 | ESP32.8 7.03,48.47 6.11,49.39 6.11,49.98 5.84,50.24 v5.84,50.67
  Bottom 0.254: SD_CARD.CD/DAT3 16.4,16.27 17.8,17.68 17.8,18.81 17.01,19.61 v15.22,19.61 | v12.7,19.1 12,19.8 7.68,19.8 6.6,20.88 6.6,22.69 6.75,22.84 6.75,27.96 5.25,29.47 5.25,50.36 5.56,50.67 v5.84,50.67
IO33  (via drill 0.35)
  Top 0.254: v14.68,38.68 14.68,41.9 14.44,42.15 14.44,43.33 v15.09,43.98 | v10.16,47.12 8.58,47.12 ESP32.9
  Bottom 0.254: v15.09,43.98 15.09,46.5 14.48,47.12 v10.16,47.12 | U$34.13 17.25,32.68 17.94,33.37 17.94,34.28 17.86,34.36 17.86,36.04 17.35,36.55 16.59,36.55 16.2,36.94 16.2,37.16 v14.68,38.68
IO34  (via drill 0.35)
  Top 0.254: v12.7,51.05 12.95,50.8 12.95,45.72 13.31,45.36 13.31,44.05 14.01,43.35 v14.01,37.29 | v10.03,51.05 9.99,51.01 ESP32.6
  Bottom 0.254: v12.7,51.05 v10.03,51.05 | U$34.18 14.75,33.32 14.1,33.98 14.1,37.21 v14.01,37.29
IO35  (via drill 0.35)
  Top 0.254: ESP32.7 11.73,49.74 11.91,49.55 11.91,44.2 12.15,43.96 v12.15,36.98 | v15.54,35.69 14.78,34.92 13.59,34.92 v13.34,35.18
  Bottom 0.254: v13.34,35.18 12.15,36.36 v12.15,36.98 | U$34.16 15.75,35.48 v15.54,35.69
IO36  (via drill 0.35)
  Top 0.254: ESP32.4 11.47,53.55 11.66,53.36 11.66,51.16 12.55,50.28 12.55,44.24 12.65,44.14 12.65,37.41 12.81,37.25 12.81,36.07 10.92,34.19 v10.92,33.04
  Bottom 0.254: v10.92,33.04 11.81,33.04 12.75,32.1 U$34.22
IO39  (via drill 0.35)
  Top 0.254: ESP32.5 4.66,52.28 3.56,51.18 2.54,51.18 | 2.54,51.18 1.78,51.18 1.61,51.35 Q2.2 | 2.54,51.18 R14.2 1.51,48.18 1.51,46.54 1.65,46.4 v1.65,45.72 | v5.9,36.83 2.84,36.83 v2.33,37.34
  Bottom 0.254: U$34.20 13.74,29.93 13.74,32.4 12.34,33.8 12.34,34.05 11.96,34.44 11.43,34.44 11.39,34.44 10.26,33.31 10.26,32.96 9.68,32.37 9.61,32.3 9.29,31.98 6.21,31.98 5.65,32.53 5.65,36.58 v5.9,36.83 | v1.65,45.72 1.65,43.81 2.33,43.13 2.33,42.69 2.58,42.44 2.58,41.47 2.26,41.15 2.26,39.1 2.33,39.03 v2.33,37.34
N$2  (via drill 0.35)
  Top 0.254: v2.67,12.83 3.3,12.83 4.06,12.06 4.06,6.35 8,2.41 v8,1.52 | v32.77,6.73 32.77,11.9 33.73,12.86 33.73,14.1 v33.48,14.35 | v33.02,31.88 R7.1
  Bottom 0.254: U$1.4-DIN 2.63,12.79 v2.67,12.83 | v8,1.52 27.56,1.52 29.36,3.32 29.36,4.09 30.91,5.64 31.68,5.64 v32.77,6.73 | v33.48,14.35 33.48,18.17 31.76,19.89 31.76,25.41 33.73,27.38 33.73,31.17 v33.02,31.88
N$3
  Bottom 0.254: U$1.2-DOUT 24.73,8.51 U$2.4-DIN
N$6  (via drill 0.35)
  Top 0.254: v9.02,32.64 9.59,32.64 10.16,32.06 R11.2
  Bottom 0.254: U2.26 10.15,38.79 9.91,38.55 9.91,33.91 9.02,33.02 v9.02,32.64
N$7  (via drill 0.35)
  Top 0.254: v28.55,35.31 28.8,35.05 28.8,33.22 30.48,31.55 C15.2
  Bottom 0.254: U2.2 26.95,36.91 v28.55,35.31
N$8
  Top 0.254: Y1.3 10.34,20.25 10.79,20.7 U$23.8
N$9  (via drill 0.35)
  Top 0.254: C15.1 28.97,31.04 28.97,32.2 28.34,32.82 28.34,33.16 28.15,33.36 v28.15,34.16
  Bottom 0.254: v28.15,34.16 26.25,36.06 U2.3
N$10  (via drill 0.35)
  Top 0.254: C7.2 27.94,32.64 v27.69,32.89
  Bottom 0.254: v27.69,32.89 25.55,35.03 U2.4
N$11  (via drill 0.35)
  Top 0.254: C7.1 26.92,30.55 v26.67,30.55
  Bottom 0.254: v26.67,30.55 26.67,33.33 24.85,35.15 U2.5
N$12  (via drill 0.35)
  Top 0.254: C10.2 6.65,35.24 6.84,35.05 6.84,33.91 v7.35,33.4
  Bottom 0.254: U2.28 8.75,34.15 8,33.4 v7.35,33.4
N$13  (via drill 0.35)
  Top 0.254: C12.2 7.62,32.38 v7.87,32.64
  Bottom 0.254: v7.87,32.64 9.45,34.22 U2.27
N$16
  Top 0.254: Y1.1 9.47,17.85 9.78,18.16 9.78,19.68 9.94,19.84 11.59,19.84 12.06,20.32 U$23.7
N$22
  Top 0.254: U$23.4 15.88,17.38 15.62,17.13 15.46,17.13 15.3,16.97 15.3,15.64 15.02,15.37 13.86,15.37 C14.1
N$23  (via drill 0.35)
  Top 0.254: v28.83,47.24 30.41,47.24 R15.1 | U$23.2 18.41,21.08 18.52,20.98 18.53,20.98 18.78,20.73 20.85,20.73 21.33,21.2 21.33,21.34 v21.58,21.59
  Bottom 0.254: v28.83,47.24 29.72,46.35 29.72,29.02 28.2,27.5 28.2,24.26 27.3,23.37 26.96,23.37 26.94,23.39 23.38,23.39 v21.58,21.59
N$24  (via drill 0.35)
  Top 0.254: v33.02,45.97 R16.1 | U$23.3 17.14,22.82 17.17,22.84 17.17,23.39 17.14,23.41 17.14,23.5 17.4,23.75 20.07,23.75 20.82,24.51 20.82,25.96 21.19,26.33 22,26.33 22.49,25.84 22.49,25.43 v22.91,25.02
  Bottom 0.254: v33.02,45.97 31.03,45.97 29.1,47.9 28.56,47.9 28.17,47.52 28.17,46.84 29.31,45.7 29.31,30.07 27.33,28.09 27.33,24.37 26.94,23.98 23.94,23.98 v22.91,25.02
N$25
  Top 0.254: Q5.1 9.21,11.36 9.65,10.92 10.87,10.92 11.19,10.61 11.19,9.92 11.3,9.8 14.12,9.8 14.31,10 14.31,10.28 14.9,10.87 15.15,10.87 15.24,10.96 R17.2
N$26  (via drill 0.35)
  Top 0.254: Q6.1 5.4,11.24 v5.46,11.18 | v18.99,11.3 18.03,12.26 R18.2
  Bottom 0.254: v5.46,11.18 6.57,11.18 6.66,11.08 18.77,11.08 v18.99,11.3
RTS  (via drill 0.35)
  Top 0.152: Q5.2 10.84,12.47 10.29,12.47 8.54,14.23 8.54,14.98 8.89,15.34 8.92,15.34 9.71,16.13
  Top 0.254: R18.1 17.14,14.79 U$23.14 17.14,17.46 17.19,17.51 17.19,18.05 17.14,18.1 v17.14,18.54 | 9.71,16.13 v9.71,16.15 | v13.47,18.45 14.97,18.45 v15.22,18.7
  Bottom 0.254: v9.71,16.15 12.01,18.45 v13.47,18.45 | v15.22,18.7 16.99,18.7 v17.14,18.54
RXD
  Top 0.254: ESP32.35 32.68,53.55 33.02,53.21 R16.2
RXD_SEC  (via drill 0.35)
  Top 0.254: R3.2 27.94,6.99 28.19,6.73 28.19,6.35 | 28.19,6.35 30.99,6.35 32.26,7.62 32.26,13.97 32,14.23 Q1.3 | CN1.3 17.5,4.09 v17.78,3.81 | v28.19,4.32 28.19,6.35
  Bottom 0.254: v17.78,3.81 20.92,3.81 21.75,2.98 26.85,2.98 v28.19,4.32
TXD
  Top 0.254: ESP32.34 30.02,52.28 30.48,51.82 R15.2
TXD_SEC  (via drill 0.35)
  Top 0.254: v25.4,10.92 25.65,11.18 25.65,13.98 Q4.3 | CN1.2 19.5,10.48 v19.56,10.54 19.48,10.47 15.07,10.47 14.72,10.12 14.72,9.64 14.48,9.4 10.6,9.4 R9.2
  Bottom 0.254: v19.56,10.54 19.56,10.58 20.18,11.2 22.88,11.2 23.26,10.81 23.26,10.64 23.5,10.41 24.89,10.41 v25.4,10.92
VBUS  (via drill 0.35)
  Top 0.254: C4.1 5.89,29.4 VREG.1 | VREG.1 5.13,29.23 USB.VBUS 6.81,23.91 7.58,23.14 13.38,23.14 13.53,22.99 v14.5,22.99 | VREG.3 3.87,31.3 3.68,31.11 3.68,29.59 3.87,29.4 VREG.1 | C21.1 21.59,14.21 | 21.59,14.21 C20.1 19.68,14.84 U$23.16 20.19,16.25 20.45,16.5 v20.45,17.53 | 21.59,14.21 21.5,14.12 CN1.1 21.58,7.62 | R3.1 27.62,9.84 25.4,7.62 21.58,7.62 | C1.1 10.11,7.89 R9.1 v10.16,2.67 | v20.54,4.57 20.79,4.82 20.79,5.3 21.58,6.09 21.58,7.62 | v23.75,28.19 23.62,28.07 22.99,28.07 | 22.99,28.07 PS1.3 | v18.92,19.56 17.99,19.56 v17.31,20.23 | PS2.3 19.58,28.6 22.46,28.6 22.99,28.07
  Bottom 0.254: v10.16,2.67 14.82,2.67 16.09,3.94 16.09,4.28 16.64,4.83 20.28,4.83 v20.54,4.57 | v23.75,28.19 22.25,26.69 22.25,23.01 21.49,22.25 21.31,22.25 20.92,21.86 20.92,21.68 20.83,21.59 20.83,19.56 20.66,19.56 | 20.66,19.56 v18.92,19.56 | v17.31,20.23 15.52,20.23 15.49,20.26 15.11,20.26 14.26,21.11 14.26,22.74 v14.5,22.99 | 20.66,19.56 20.45,19.34 v20.45,17.53

### Text on the board
bPlace: 30 | 1
bNames: ESP32 CAMERA